# Altium schematic sheet Sheet2.SCHDOC
size A4
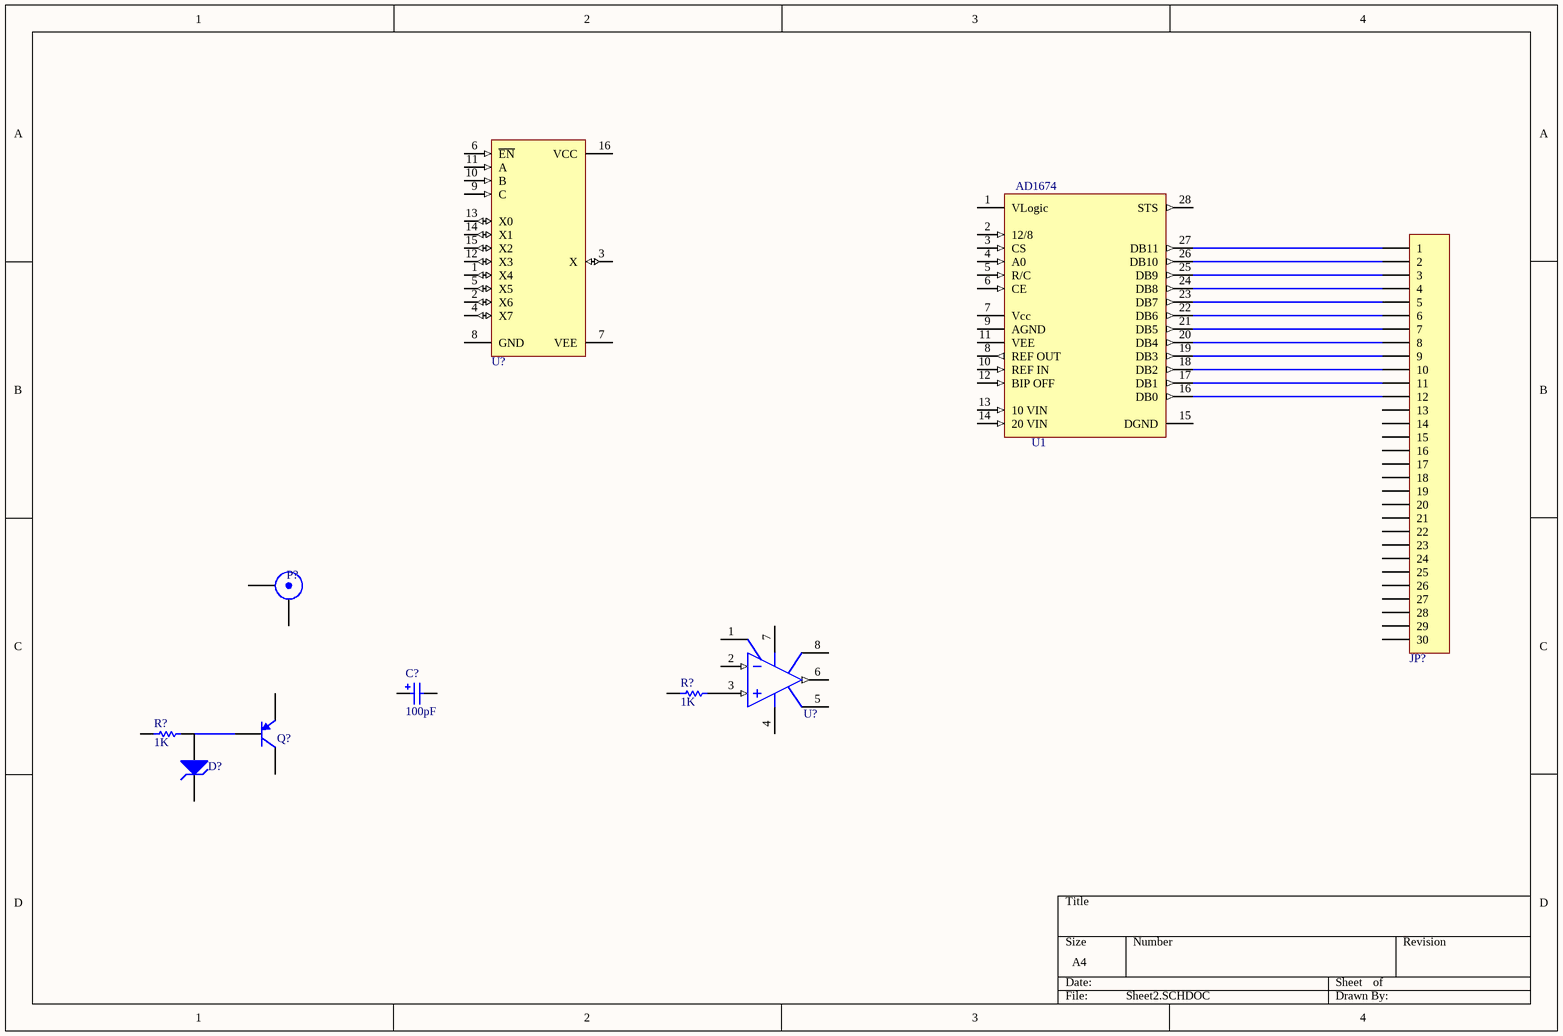
[diagram p0: Sheet2.SCHDOC]

## Parts
(Parts that share a designator on the sheet are numbered #1, #2 ... from top to bottom, then left to right.)
C?  value 100pF  [RB7.6-15]
D?  (no value)  [DIODE-0.7]
JP?  (no value)  [HDR1X30]
P?  (no value)  [BNC_RA CON]
Q?  (no value)  [BCY-W3/D4.7]
R?#1  value 1K  [AXIAL-0.3]
R?#2  value 1K  [AXIAL-0.3]
U1  AD1674  [DIP-28/E13]
U?#1  (no value)  [DIP-16]
U?#2  (no value)  [DIP-8]

## Nets
NetD?_1: D?.1(A) R?#2.2
NetR?#1_2: R?#1.2 U?#2.3(IN+)

Not connected (* = marked no-connect by the designer): C? 1 2; D? 2(K); JP? 1 2 3 4 5 6 7 8 9 10 11 12 13 14 15 16 17 18 19 20 21 22 23 24 25 26 27 28 29 30; P? 1(X) 2(Y); Q? 1(E) 2(B) 3(C); R?#1 1; R?#2 1; U1 1(VLogic) 2(12/8) 3(CS) 4(A0) 5(R/C) 6(CE) 7(Vcc) 8(REF_OUT) 9(AGND) 10(REF_IN) 11(VEE) 12(BIP_OFF) 13(10_VIN) 14(20_VIN) 15(DGND) 16(DB0) 17(DB1) 18(DB2) 19(DB3) 20(DB4) 21(DB5) 22(DB6) 23(DB7) 24(DB8) 25(DB9) 26(DB10) 27(DB11) 28(STS); U?#1 1(X4) 2(X6) 3(X) 4(X7) 5(X5) 6(~{EN}) 7(VEE) 8(GND) 9(C) 10(B) 11(A) 12(X3) 13(X0) 14(X1) 15(X2) 16(VCC); U?#2 1(VOSTRIM) 2(IN-) 4(V-) 5(NC) 6(OUT) 7(V+) 8(VOSTRIM)

## Library data of the parts
C? = Cap Pol1: Polarized Capacitor (Radial); Manufacturer: Generic Components; Class: Passive; Published: 08/06/2000; Publisher: Altium Hobart Technology Centre; SubClass: Capacitor
D? = D Zener: Zener Diode; Manufacturer: Generic Components; Class: Discrete; SubClass: Diode - Zener; Published: 08/06/2000; Publisher: Altium Hobart Technology Centre
JP? = Header 30: Header, 30-Pin; Manufacturer: Generic Components; Class: Connector
P? = BNC: BNC Elbow Connector; Manufacturer: Generic Components; SubClass: RF Coaxial; Class: Connector
Q? = 2N3906: PNP General Purpose Amplifier; Manufacturer: Generic Components; Revised: 11-July-2000: SIM Model Added.; Class: Discrete; SubClass: BJT - Low Power; Published: 08/06/2000; Publisher: Altium Hobart Technology Centre
R?#1 R?#2 = Res1: Resistor; Manufacturer: Generic Components; Class: Passive; Published: 08/06/2000; Publisher: Altium Hobart Technology Centre; SubClass: Resistor
U1 = AD1674: 12 Bit Analog to Digital Converter; Manufacturer: ANLOG DEVICE; Class: A/D; SubClass: 12-bit; Published: 8-Jun-2005.; Publisher: Salar Basiri
U?#1 = CD4051BCN: 8-Channel Analog Multiplexer/Demultiplexer; Manufacturer: Fairchild Semiconductor; Class: Logic; SubClass: Multiplexer/Encoder/Selector; Published: 15/04/2002; Publisher: Altium Hobart Technology Centre
U?#2 = OP177AZ: Ultraprecision Operational Amplifier; Manufacturer: Analog Devices; Revised: 10-July-2000: SIM Model Added.; Note: Pin 5 is not connected.; Published: 8/06/2000; Publisher: Altium Hobart Technology Centre; Class: Amplifier; SubClass: Operational Amplifier